# Altium schematic sheet IMUOld.SchDoc
size A4
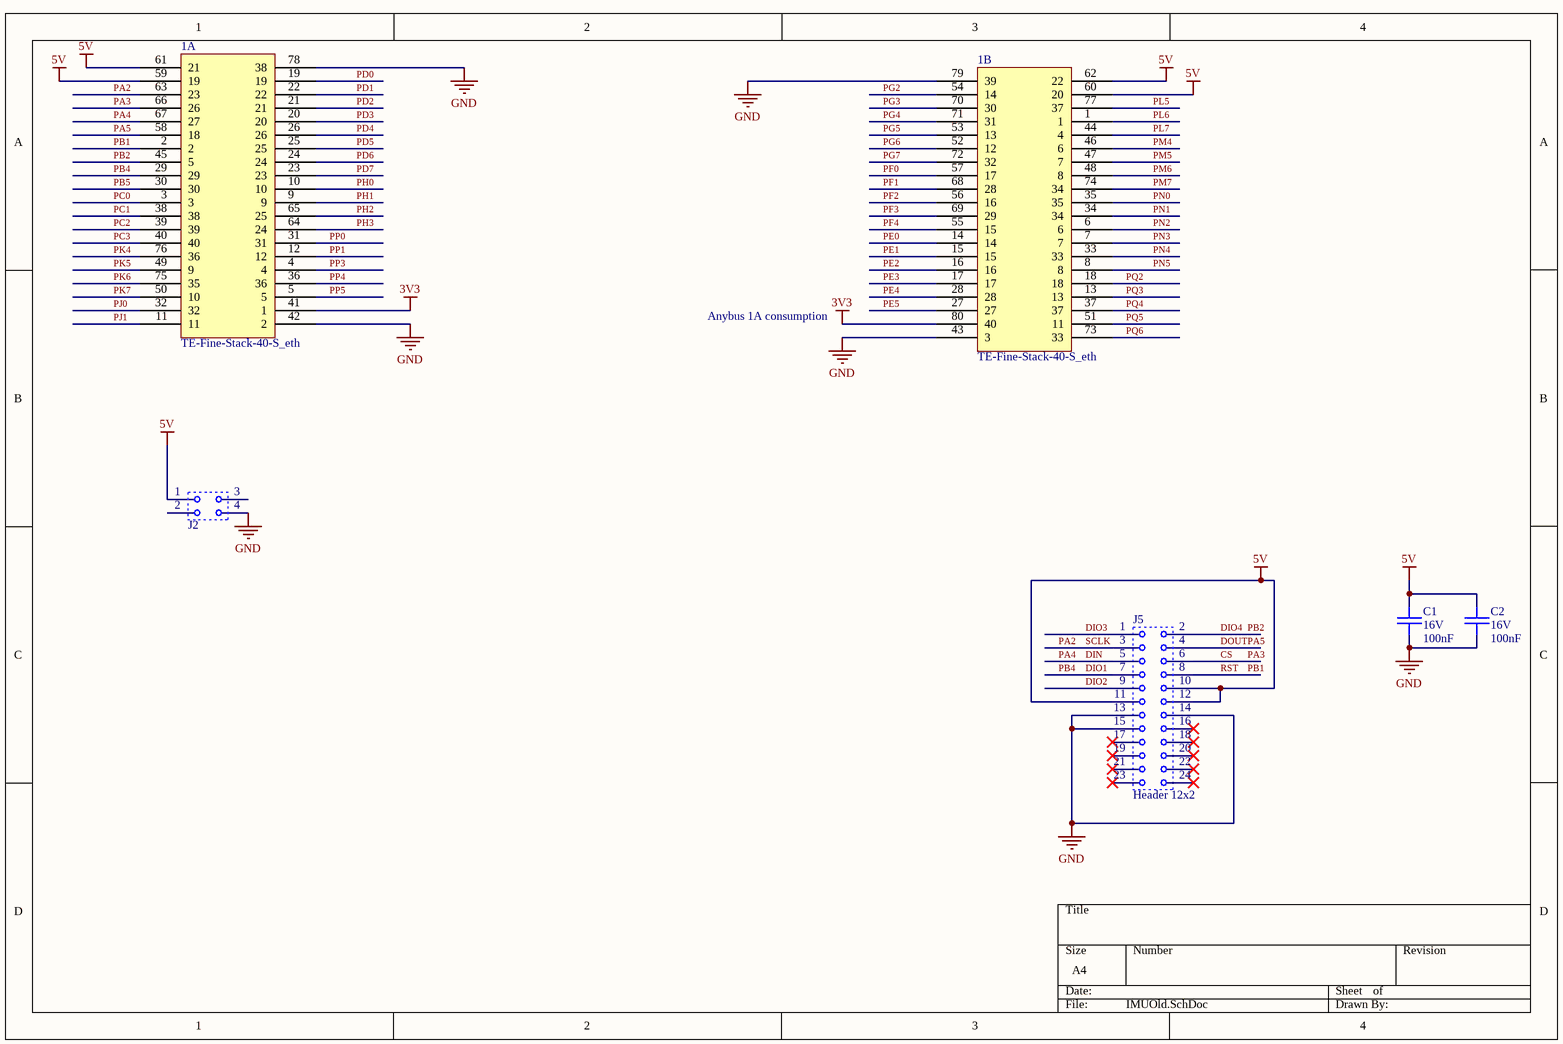
[diagram p0: IMUOld.SchDoc]

## Parts
1  TE-Fine-Stack-40-S_eth  [TE-FINE-STACK-40-P-Eth]  (parts A,B of 2)
C1  value 100nF  Voltage: 16V  [0805]  (hidden comment: 100n)
C2  value 100nF  Voltage: 16V  [0805]  (hidden comment: 100n)
J2  Molex Microfit  [MICROFIT 2x2 Right Angle]  (value not drawn)
J5  Header 12x2  [CLM-112-02]

## Nets
3V3: 1.41(1) 1.80(40)
5V: 1.59(19) 1.60(20) 1.61(21) 1.62(22) C1.1 C2.1 J2.1 J5.10 J5.11 J5.12
GND: 1.42(2) 1.43(3) 1.78(38) 1.79(39) C1.2 C2.2 J2.4 J5.13 J5.14 J5.15
CS: 1.66(26) J5.6  [also labelled PA3]
DIN: 1.67(27) J5.5  [also labelled PA4]
DIO1: 1.29 J5.7  [also labelled PB4]
DIO2: J5.9
DIO3: J5.1
DIO4: 1.45(5) J5.2  [also labelled PB2]
DOUT: 1.58(18) J5.4  [also labelled PA5]
PA2: 1.63(23) J5.3  [also labelled SCLK]
PB1: 1.2 J5.8  [also labelled RST]
PB5: 1.30
PC0: 1.3
PC1: 1.38
PC2: 1.39
PC3: 1.40
PD0: 1.19
PD1: 1.22
PD2: 1.21
PD3: 1.20
PD4: 1.26
PD5: 1.25
PD6: 1.24
PD7: 1.23
PE0: 1.14
PE1: 1.15
PE2: 1.16
PE3: 1.17
PE4: 1.28
PE5: 1.27
PF0: 1.57(17)
PF1: 1.68(28)
PF2: 1.56(16)
PF3: 1.69(29)
PF4: 1.55(15)
PG2: 1.54(14)
PG3: 1.70(30)
PG4: 1.71(31)
PG5: 1.53(13)
PG6: 1.52(12)
PG7: 1.72(32)
PH0: 1.10
PH1: 1.9
PH2: 1.65(25)
PH3: 1.64(24)
PJ0: 1.32
PJ1: 1.11
PK4: 1.76(36)
PK5: 1.49(9)
PK6: 1.75(35)
PK7: 1.50(10)
PL5: 1.77(37)
PL6: 1.1
PL7: 1.44(4)
PM4: 1.46(6)
PM5: 1.47(7)
PM6: 1.48(8)
PM7: 1.74(34)
PN0: 1.35
PN1: 1.34
PN2: 1.6
PN3: 1.7
PN4: 1.33
PN5: 1.8
PP0: 1.31
PP1: 1.12
PP3: 1.4
PP4: 1.36
PP5: 1.5
PQ2: 1.18
PQ3: 1.13
PQ4: 1.37
PQ5: 1.51(11)
PQ6: 1.73(33)

Not connected (* = marked no-connect by the designer): J2 2 3; J5 16* 17* 18* 19* 20* 21* 22* 23* 24*

## Notes on the sheet
- Anybus 1A consumption

## Library data of the parts
C1 C2 = C_CER: Ceramic Capacitor
J2 = Microfit 2x2 Right Angle